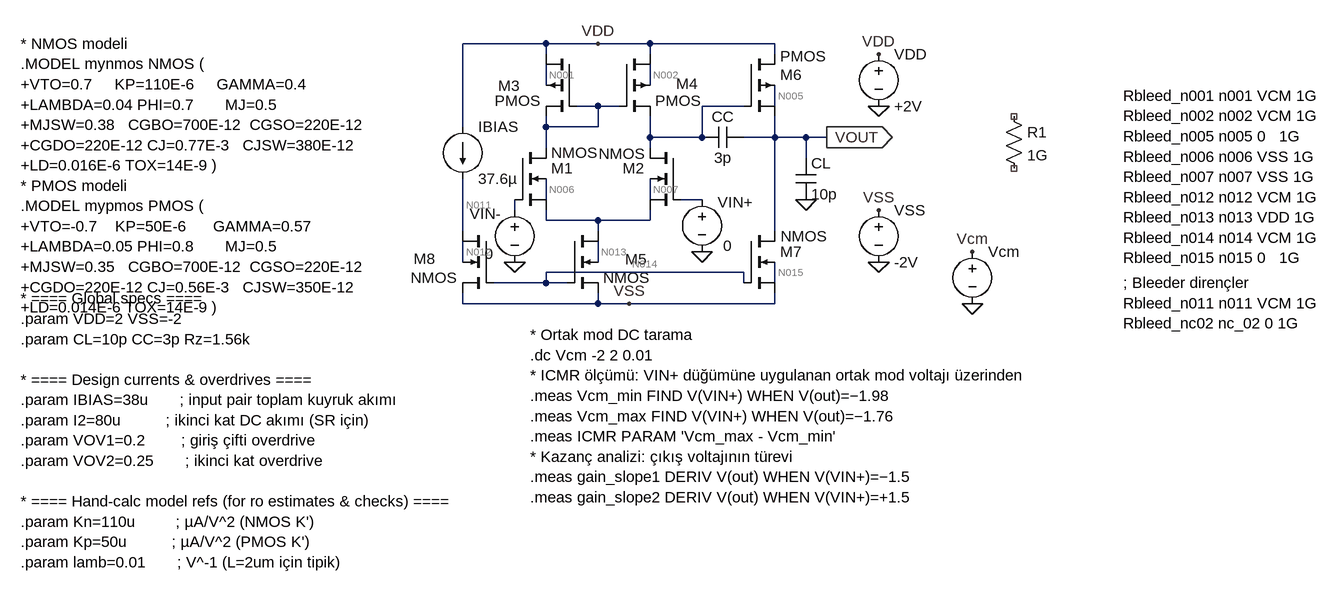
[diagram p0: schematic unbuffered_ICMR.asc]
unbuffered_ICMR.asc, the LTspice schematic file:
Version 4.1
SHEET 1 1772 2040
WIRE 48 -32 -80 -32
WIRE 128 -32 48 -32
WIRE 208 -32 128 -32
WIRE 400 -32 208 -32
WIRE 48 -16 48 -32
WIRE 208 -16 208 -32
WIRE 400 -16 400 -32
WIRE 48 32 48 0
WIRE 208 32 208 0
WIRE 128 64 96 64
WIRE 160 64 128 64
WIRE 352 64 288 64
WIRE 400 64 400 32
WIRE -80 96 -80 -32
WIRE 48 96 48 80
WIRE 128 96 128 64
WIRE 128 96 48 96
WIRE 208 112 208 80
WIRE 288 112 288 64
WIRE 288 112 208 112
WIRE 400 112 400 80
WIRE 400 112 352 112
WIRE 448 112 400 112
WIRE 480 112 448 112
WIRE 48 128 48 96
WIRE 208 128 208 112
WIRE 480 128 480 112
WIRE 448 144 448 112
WIRE 48 208 48 176
WIRE 208 208 208 176
WIRE 288 208 256 208
WIRE 0 224 0 208
WIRE 48 240 48 224
WIRE 128 240 48 240
WIRE 208 240 208 224
WIRE 208 240 128 240
WIRE -80 256 -80 176
WIRE 128 256 128 240
WIRE 400 256 400 112
WIRE -80 304 -80 272
WIRE 128 304 128 272
WIRE 352 320 48 320
WIRE 48 336 48 320
WIRE 48 336 -32 336
WIRE 80 336 48 336
WIRE 352 336 352 320
WIRE 400 336 400 304
WIRE -80 368 -80 352
WIRE 128 368 128 352
WIRE 128 368 -80 368
WIRE 176 368 128 368
WIRE 400 368 400 352
WIRE 400 368 176 368
FLAG 560 64 0
FLAG 560 304 0
FLAG 0 304 0
FLAG 288 288 0
FLAG 448 208 0
FLAG 480 112 VOUT
IOPIN 480 112 Out
FLAG 128 -32 VDD
FLAG 176 368 VSS
FLAG 560 224 VSS
FLAG 560 -16 VDD
FLAG 704 368 0
FLAG 704 288 Vcm
SYMBOL voltage 560 -32 R0
SYMATTR InstName VDD
SYMATTR Value +2V
SYMBOL voltage 560 208 R0
SYMATTR InstName VSS
SYMATTR Value -2V
SYMBOL nmos4 0 128 R0
WINDOW 3 56 8 Left 2
SYMATTR InstName M1
SYMATTR Value2 l=2 w=17
SYMBOL nmos4 256 128 M0
WINDOW 3 55 9 Left 2
SYMATTR InstName M2
SYMATTR Value2 l=2 w=17
SYMBOL pmos4 96 -16 M0
WINDOW 0 88 49 Left 2
SYMATTR InstName M3
SYMATTR Value2 l=2 w=20
SYMBOL pmos4 160 -16 R0
WINDOW 0 88 46 Left 2
SYMATTR InstName M4
SYMATTR Value2 l=2 w=20
SYMBOL nmos4 80 256 R0
WINDOW 0 90 44 Left 2
SYMATTR InstName M5
SYMATTR Value2 l=2 w=102
SYMBOL pmos4 352 -16 R0
WINDOW 3 56 3 Left 2
SYMATTR InstName M6
SYMATTR Value2 l=2 w=46.6
SYMBOL cap 352 96 R90
WINDOW 0 0 32 VBottom 2
WINDOW 3 32 32 VTop 2
SYMATTR InstName CC
SYMATTR Value 3p
SYMATTR SpiceLine Rser=1
SYMBOL nmos4 352 256 R0
WINDOW 3 57 8 Left 2
SYMATTR InstName M7
SYMATTR Value2 l=2 w=10
SYMBOL nmos4 -32 256 M0
WINDOW 0 90 43 Left 2
SYMATTR InstName M8
SYMATTR Value2 l=2 w=20
SYMBOL voltage 288 192 R0
WINDOW 3 33 87 Left 2
WINDOW 123 24 48 Left 2
WINDOW 39 0 0 Left 0
WINDOW 0 24 20 Left 2
SYMATTR Value 0
SYMATTR InstName VIN+
SYMBOL voltage 0 208 M0
WINDOW 123 33 111 Left 2
WINDOW 39 0 0 Left 0
WINDOW 0 21 22 Left 2
WINDOW 3 33 83 Left 2
SYMATTR InstName VIN-
SYMATTR Value 0
SYMBOL current -80 96 R0
WINDOW 123 0 0 Left 0
WINDOW 39 24 108 Left 2
SYMATTR InstName IBIAS
SYMATTR Value 37.6µ
SYMBOL cap 432 144 R0
SYMATTR InstName CL
SYMATTR Value 10p
SYMBOL res 752 64 R0
SYMATTR InstName R1
SYMATTR Value 1G
SYMBOL voltage 704 272 R0
WINDOW 123 0 0 Left 0
WINDOW 39 0 0 Left 0
SYMATTR InstName Vcm
SYMATTR Value ""
TEXT -760 -32 Left 2 !* NMOS modeli\n.MODEL mynmos NMOS (\n+VTO=0.7     KP=110E-6     GAMMA=0.4\n+LAMBDA=0.04 PHI=0.7       MJ=0.5\n+MJSW=0.38   CGBO=700E-12  CGSO=220E-12\n+CGDO=220E-12 CJ=0.77E-3   CJSW=380E-12\n+LD=0.016E-6 TOX=14E-9 )\n* PMOS modeli\n.MODEL mypmos PMOS (\n+VTO=-0.7    KP=50E-6      GAMMA=0.57\n+LAMBDA=0.05 PHI=0.8       MJ=0.5\n+MJSW=0.35   CGBO=700E-12  CGSO=220E-12\n+CGDO=220E-12 CJ=0.56E-3   CJSW=350E-12\n+LD=0.014E-6 TOX=14E-9 )
TEXT -760 360 Left 2 !* ==== Global specs ====\n.param VDD=2 VSS=-2\n.param CL=10p CC=3p Rz=1.56k\n \n* ==== Design currents & overdrives ====\n.param IBIAS=38u       ; input pair toplam kuyruk akımı\n.param I2=80u          ; ikinci kat DC akımı (SR için)\n.param VOV1=0.2        ; giriş çifti overdrive\n.param VOV2=0.25       ; ikinci kat overdrive\n \n* ==== Hand-calc model refs (for ro estimates & checks) ====\n.param Kn=110u         ; µA/V^2 (NMOS K')\n.param Kp=50u          ; µA/V^2 (PMOS K')\n.param lamb=0.01       ; V^-1 (L=2um için tipik)
TEXT 936 48 Left 2 !Rbleed_n001 n001 VCM 1G\nRbleed_n002 n002 VCM 1G\nRbleed_n005 n005 0   1G\nRbleed_n006 n006 VSS 1G\nRbleed_n007 n007 VSS 1G\nRbleed_n012 n012 VCM 1G\nRbleed_n013 n013 VDD 1G\nRbleed_n014 n014 VCM 1G\nRbleed_n015 n015 0   1G
TEXT 936 336 Left 2 !; Bleeder dirençler\nRbleed_n011 n011 VCM 1G\nRbleed_nc02 nc_02 0 1G
TEXT 24 416 Left 2 !* Ortak mod DC tarama\n.dc Vcm -2 2 0.01\n* ICMR ölçümü: VIN+ düğümüne uygulanan ortak mod voltajı üzerinden\n.meas Vcm_min FIND V(VIN+) WHEN V(out)=−1.98\n.meas Vcm_max FIND V(VIN+) WHEN V(out)=−1.76\n.meas ICMR PARAM 'Vcm_max - Vcm_min'\n* Kazanç analizi: çıkış voltajının türevi\n.meas gain_slope1 DERIV V(out) WHEN V(VIN+)=−1.5\n.meas gain_slope2 DERIV V(out) WHEN V(VIN+)=+1.5

The netlist it stands for:
* unbuffered_ICMR.asc
VDD VDD 0 +2V
VSS VSS 0 -2V
M1 N003 N009 N010 N006 NMOS l=2 w=17
M2 N004 N008 N010 N007 NMOS l=2 w=17
M3 VDD N003 N003 N001 PMOS l=2 w=20
M4 VDD N003 N004 N002 PMOS l=2 w=20
M5 N010 N014 VSS N013 NMOS l=2 w=102
M6 VDD N004 VOUT N005 PMOS l=2 w=46.6
CC VOUT N004 3p Rser=1
M7 VOUT N014 VSS N015 NMOS l=2 w=10
M8 N011 N014 VSS N012 NMOS l=2 w=20
VIN+ N008 0 0
VIN- N009 0 0
IBIAS VDD N011 37.6µ
CL VOUT 0 10p
R1 NC_01 NC_02 1G
Vcm Vcm 0
.model NMOS NMOS
.model PMOS PMOS
.lib standard.mos
* NMOS modeli
.MODEL mynmos NMOS (
+VTO=0.7     KP=110E-6     GAMMA=0.4
+LAMBDA=0.04 PHI=0.7       MJ=0.5
+MJSW=0.38   CGBO=700E-12  CGSO=220E-12
+CGDO=220E-12 CJ=0.77E-3   CJSW=380E-12
+LD=0.016E-6 TOX=14E-9 )
* PMOS modeli
.MODEL mypmos PMOS (
+VTO=-0.7    KP=50E-6      GAMMA=0.57
+LAMBDA=0.05 PHI=0.8       MJ=0.5
+MJSW=0.35   CGBO=700E-12  CGSO=220E-12
+CGDO=220E-12 CJ=0.56E-3   CJSW=350E-12
+LD=0.014E-6 TOX=14E-9 )
* ==== Global specs ====
.param VDD=2 VSS=-2
.param CL=10p CC=3p Rz=1.56k
* ==== Design currents & overdrives ====
.param IBIAS=38u       ; input pair toplam kuyruk akımı
.param I2=80u          ; ikinci kat DC akımı (SR için)
.param VOV1=0.2        ; giriş çifti overdrive
.param VOV2=0.25       ; ikinci kat overdrive
* ==== Hand-calc model refs (for ro estimates & checks) ====
.param Kn=110u         ; µA/V^2 (NMOS K')
.param Kp=50u          ; µA/V^2 (PMOS K')
.param lamb=0.01       ; V^-1 (L=2um için tipik)
Rbleed_n001 n001 VCM 1G
Rbleed_n002 n002 VCM 1G
Rbleed_n005 n005 0   1G
Rbleed_n006 n006 VSS 1G
Rbleed_n007 n007 VSS 1G
Rbleed_n012 n012 VCM 1G
Rbleed_n013 n013 VDD 1G
Rbleed_n014 n014 VCM 1G
Rbleed_n015 n015 0   1G
; Bleeder dirençler
Rbleed_n011 n011 VCM 1G
Rbleed_nc02 nc_02 0 1G
* Ortak mod DC tarama
.dc Vcm -2 2 0.01
* ICMR ölçümü: VIN+ düğümüne uygulanan ortak mod voltajı üzerinden
.meas Vcm_min FIND V(VIN+) WHEN V(out)=−1.98
.meas Vcm_max FIND V(VIN+) WHEN V(out)=−1.76
.meas ICMR PARAM 'Vcm_max - Vcm_min'
* Kazanç analizi: çıkış voltajının türevi
.meas gain_slope1 DERIV V(out) WHEN V(VIN+)=−1.5
.meas gain_slope2 DERIV V(out) WHEN V(VIN+)=+1.5
.backanno
.end